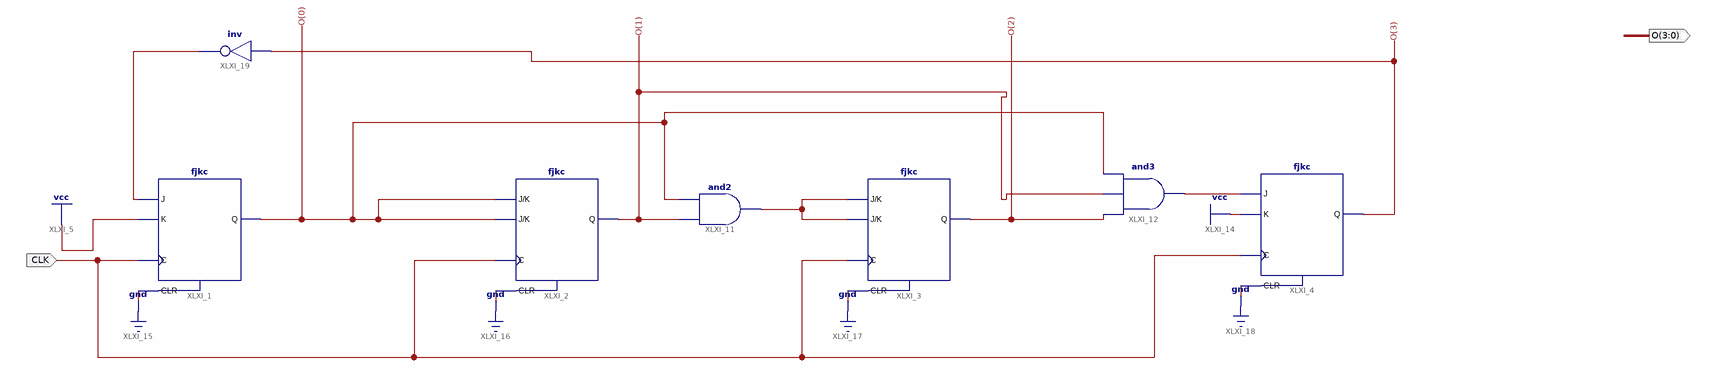
[diagram p0: schematic sheet 1]
// Xilinx ISE schematic counter0_8.sch (spartan6) as structural Verilog: 7 symbols, 2 ports
module counter0_8 (
  input  CLK,
  output [3:0] O
);

  wire XLXN_10, XLXN_19, XLXN_31;

  fjkc XLXI_2 (.C(CLK), .CLR(1'b0), .J(O[0]), .K(O[0]), .Q(O[1]));
  fjkc XLXI_3 (.C(CLK), .CLR(1'b0), .J(XLXN_10), .K(XLXN_10), .Q(O[2]));
  fjkc XLXI_4 (.C(CLK), .CLR(1'b0), .J(XLXN_19), .K(1'b1), .Q(O[3]));
  fjkc XLXI_1 (.C(CLK), .CLR(1'b0), .J(XLXN_31), .K(1'b1), .Q(O[0]));
  and XLXI_11 (XLXN_10, O[1], O[0]);
  and XLXI_12 (XLXN_19, O[2], O[1], O[0]);
  not XLXI_19 (XLXN_31, O[3]);
endmodule
